# Altium schematic sheet HM_RETI_Ambilight_v1_0.SchDoc
size A4; Organization: Altium Limited; Address1: L3, 12a Rodborough Rd; Address2: Frenchs Forest; Address3: NSW; Address4: Australia 2086; DocumentNumber: 1; SheetNumber: 1; SheetTotal: 4
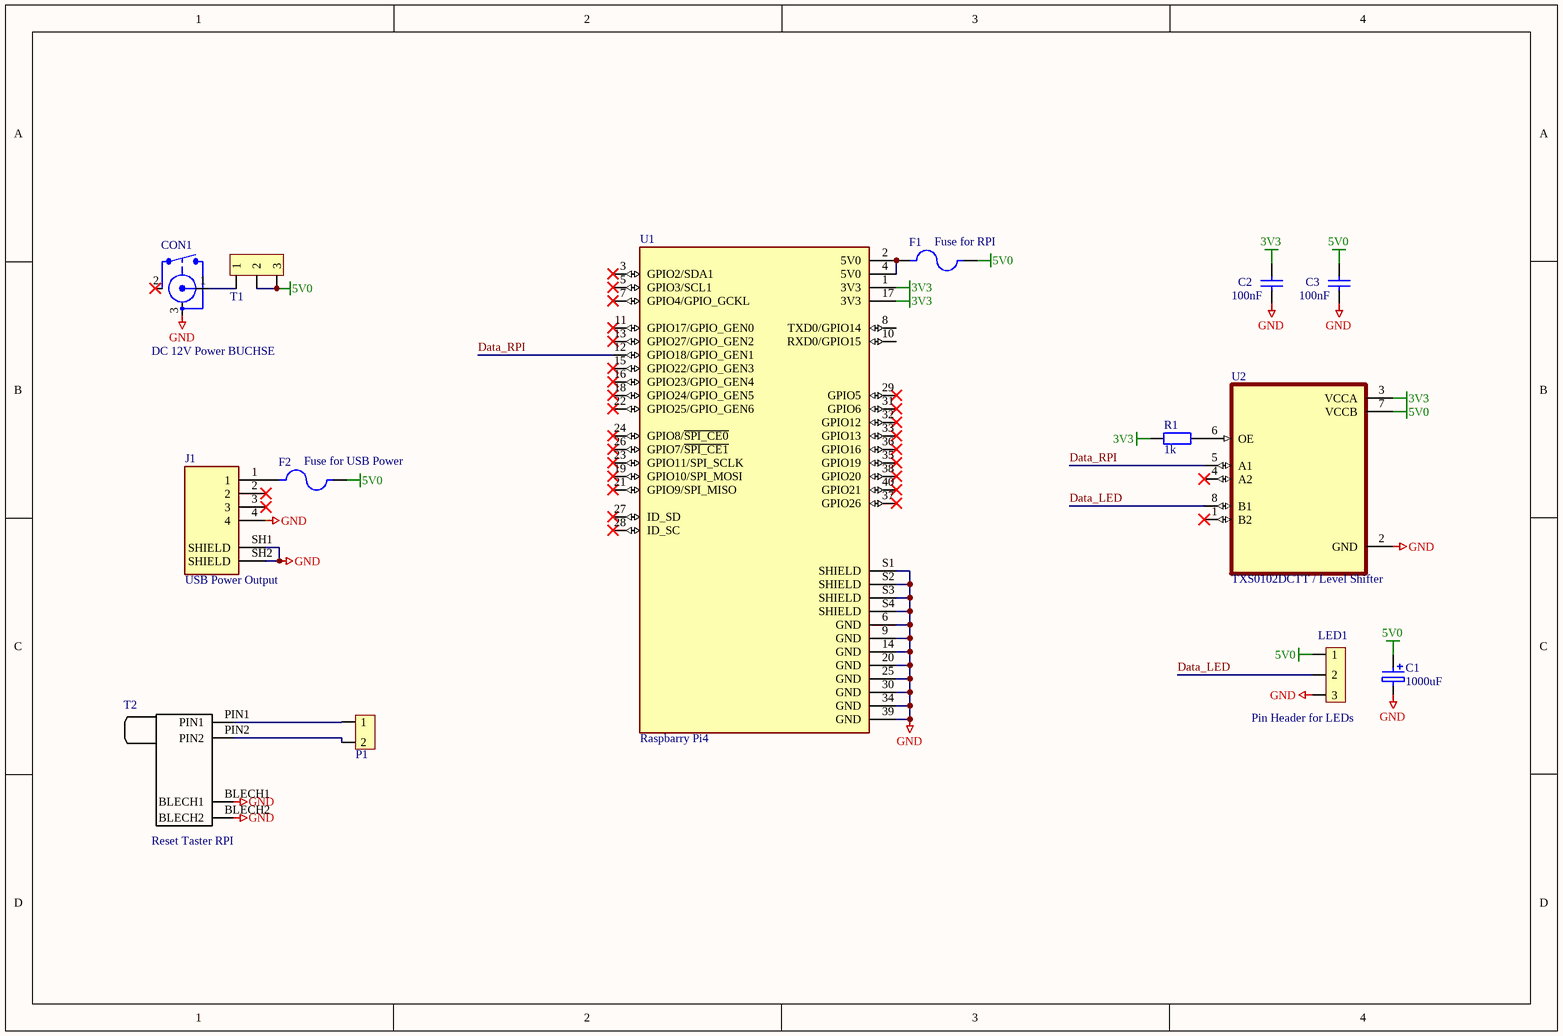
[diagram p0: HM_RETI_Ambilight_v1_0.SchDoc]

## Parts
C1  1000uF  [C_10mm_left]
C2  100nF  [C_0603]
C3  100nF  [C_0603]
CON1  DC 12V Power BUCHSE  [DC_BUCHSE_LUMBERG_2_35mm_STIFT]
F1  Fuse for RPI  [FUSER_MF-MSMF250/16X-2]
F2  Fuse for USB Power  [FUSER_MF-MSMF250/16X-2]
J1  USB Power Output  [CUI_UJ2-AH-4-TH]
LED1  Pin Header for LEDs  [Header 3x1]
P1  Pin Header 2x1  [Header 2x1]  (value not drawn)
R1  1k  [R_0603]
T1  Pin Header 3x1  [Header 3x1]  (value not drawn)
T2  Reset Taster RPI  [431256058736]
U1  Raspbarry Pi4  [MODULE_RASPBERRY_PI_3_MODEL_B+]
U2  TXS0102DCTT / Level Shifter  [SOP65P400X130-8N]

## Nets
3V3: C2.1 R1.1 U1.1(3V3) U1.17(3V3) U2.3(VCCA)
5V0: C1.1 C3.1 F1.2 F2.2 LED1.1 T1.2 T1.3 U2.7(VCCB)
GND: C1.2 C2.2 C3.2 CON1.3(A) J1.4 J1.SH1(SHIELD) J1.SH2(SHIELD) LED1.3 T2.BLECH1 T2.BLECH2 U1.6(GND) U1.9(GND) U1.14(GND) U1.20(GND) U1.25(GND) U1.30(GND) U1.34(GND) U1.39(GND) U1.S1(SHIELD) U1.S2(SHIELD) U1.S3(SHIELD) U1.S4(SHIELD) U2.2(GND)
Data_LED: LED1.2 U2.8(B1)
Data_RPI: U1.12(GPIO18/GPIO_GEN1) U2.5(A1)
NetCON1_1: CON1.1(I) T1.1
NetF1_1: F1.1 U1.2(5V0) U1.4(5V0)
NetF2_1: F2.1 J1.1
NetP1_1: P1.1 T2.PIN1
NetP1_2: P1.2 T2.PIN2
NetR1_2: R1.2 U2.6(OE)

Not connected (* = marked no-connect by the designer): CON1 2(SW)*; J1 2* 3*; U1 3(GPIO2/SDA1)* 5(GPIO3/SCL1)* 7(GPIO4/GPIO_GCKL)* 8(TXD0/GPIO14) 10(RXD0/GPIO15) 11(GPIO17/GPIO_GEN0)* 13(GPIO27/GPIO_GEN2)* 15(GPIO22/GPIO_GEN3)* 16(GPIO23/GPIO_GEN4)* 18(GPIO24/GPIO_GEN5)* 19(GPIO10/SPI_MOSI)* 21(GPIO9/SPI_MISO)* 22(GPIO25/GPIO_GEN6)* 23(GPIO11/SPI_SCLK)* 24(GPIO8/~{SPI_CE0})* 26(GPIO7/~{SPI_CE1})* 27(ID_SD)* 28(ID_SC)* 29(GPIO5)* 31(GPIO6)* 32(GPIO12)* 33(GPIO13)* 35(GPIO19)* 36(GPIO16)* 37(GPIO26)* 38(GPIO20)* 40(GPIO21)*; U2 1(B2)* 4(A2)*

## Library data of the parts
C1 = C ELKO: C, SMD, ELKO, 6,5V, ± 10%
C2 C3 = C SMD: C, SMD, MLCC, 25V, ± 10%
CON1 = DC_BUCHSE_LUMBERG_2_35mm_STIFT
F1 = MF-MSMF250/16X-2: Polymeric PTC Resettable Fuse 16V 2.5 A Ih Surface Mount 1812 (4532 Metric), Concave; MF: Bourns; Availability: In Stock; SnapEDA_Link: https://www.snapeda.com/parts/MF-MSMF250/16X-2/Bourns/view-part/?ref=snap; Price: None; Check_prices: https://www.snapeda.com/parts/MF-MSMF250/16X-2/Bourns/view-part/?ref=eda; Package: 1812 Bourns; MP: MF-MSMF250/16X-2; Purchase-URL: https://pricing.snapeda.com/search/part/MF-MSMF250/16X-2/?ref=eda; Value: *
F2 = MF-MSMF250/16X-2: Polymeric PTC Resettable Fuse 16V 1.1 A Ih Surface Mount 1812 (4532 Metric), Concave; MP: MF-MSMF110/16-2; MF: Bourns; Availability: In Stock; SnapEDA_Link: https://pricing.snapeda.com/parts/MF-MSMF110/16-2/Bourns/view-part?uid=330128; Price: None; Check_prices: https://pricing.snapeda.com/parts/MF-MSMF110/16-2/Bourns/view-part?uid=330128; Package: 1812 Bourns; Purchase-URL: https://pricing.snapeda.com/parts/MF-MSMF110/16-2/Bourns/view-part?uid=330128; Value: *
J1 = UJ2-AH-4-TH: Type A, USB 2.0, 1 A, Right Angle, Through Hole, USB Receptacle; MF: CUI Devices; Value: *; Check_prices: https://www.snapeda.com/parts/UJ2-AH-4-TH/CUI+Devices/view-part/?ref=eda; Package: None; CUI_purchase_URL: https://www.cuidevices.com/product/interconnect/connectors/usb-connectors/uj2-ah-4-th?utm_source=snapeda.com&utm_medium=referral&utm_campaign=snapedaBOM; Purchase-URL: https://pricing.snapeda.com/search/part/UJ2-AH-4-TH/?ref=eda; Digi-Key_Part_Number: 102-3994-ND; SnapEDA_Link: https://www.snapeda.com/parts/UJ2-AH-4-TH/CUI+Devices/view-part/?ref=snap; MP: UJ2-AH-4-TH
LED1 T1 = Pin Header 3x1: Board-to-Board-Steckverbinder, vertikal, 2.54 mm, 3 Kontakt(e), Stiftleiste, Baureihe WR-PHD
P1 = Pin Header 2x1: Board-to-Board-Steckverbinder, vertikal, 2.54 mm, 2 Kontakt(e), Stiftleiste, Baureihe WR-PHD
R1 = R SMD: R, SMD, Chip, 100mW, ± 1%
T2 = TASTER_RESET: Taster, THT, 90°, 8,35mm, black; Hersteller#: 431256083716
U1 = RASPBERRY_PI_3_MODEL_B+: BCM2835 Raspberry Pi Model B+ - ARM11, VideoCore MPU Embedded Evaluation Board; Price: None; MP: RASPBERRY_PI_3_MODEL_B+; Value: *; Availability: Unavailable; Package: None
U2 = TXS0102DCTT: 2-Bit Bidirectional Voltage-Level Shifter for Open-Drain and Push-Pull Application; MF: Texas Instruments; DigiKey-Purchase-URL: https://snapeda.com/shop?store=DigiKey&id=320760; Value: *; Package: SSOP-8 Texas Instruments; Mouser-Purchase-URL: https://snapeda.com/shop?store=Mouser&id=320760; Price: None; SnapEDA_Link: https://www.snapeda.com/parts/TXS0102DCTT/Texas%20Instruments/view-part/320760/?ref=snap; Availability: Unavailable; MP: TXS0102DCTT; Texas_Instruments-Purchase-URL: https://snapeda.com/shop?store=Texas+Instruments&id=320760